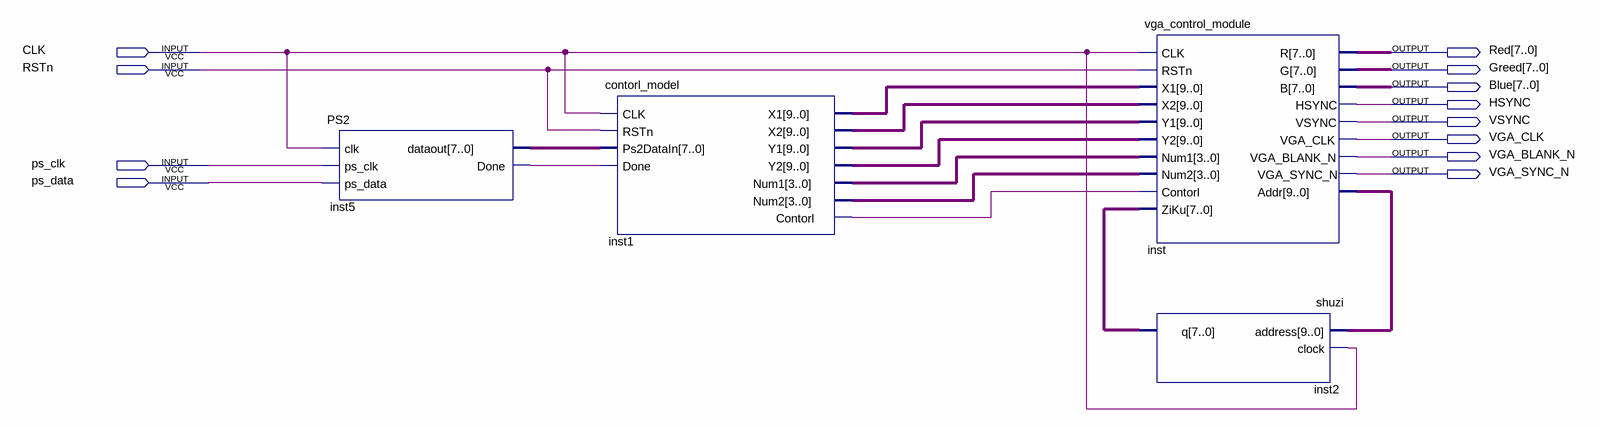
[diagram p0: schematic sheet]
// Quartus schematic top.bdf as structural Verilog: 4 symbols, 12 pins
module top (
  input  CLK,
  input  RSTn,
  input  ps_clk,
  input  ps_data,
  output [7:0] Red,
  output [7:0] Greed,
  output [7:0] Blue,
  output HSYNC,
  output VSYNC,
  output VGA_CLK,
  output VGA_BLANK_N,
  output VGA_SYNC_N
);

  wire inst1_contorl, inst5_done;
  wire [3:0] inst1_num1, inst1_num2;
  wire [7:0] inst2_q, inst5_dataout;
  wire [9:0] inst1_x1, inst1_x2, inst1_y1, inst1_y2, inst_addr;

  PS2 inst5 (.clk(CLK), .ps_clk(ps_clk), .ps_data(ps_data), .dataout(inst5_dataout), .Done(inst5_done));
  contorl_model inst1 (
    .CLK(CLK), .RSTn(RSTn), .Ps2DataIn(inst5_dataout), .Done(inst5_done), .X1(inst1_x1), .X2(inst1_x2),
    .Y1(inst1_y1), .Y2(inst1_y2), .Num1(inst1_num1), .Num2(inst1_num2), .Contorl(inst1_contorl));
  vga_control_module inst (
    .CLK(CLK), .RSTn(RSTn), .X1(inst1_x1), .X2(inst1_x2), .Y1(inst1_y1), .Y2(inst1_y2), .Num1(inst1_num1),
    .Num2(inst1_num2), .Contorl(inst1_contorl), .ZiKu(inst2_q), .R(Red), .G(Greed), .B(Blue), .HSYNC(HSYNC),
    .VSYNC(VSYNC), .VGA_CLK(VGA_CLK), .VGA_BLANK_N(VGA_BLANK_N), .VGA_SYNC_N(VGA_SYNC_N), .Addr(inst_addr));
  shuzi inst2 (.address(inst_addr), .clock(CLK), .q(inst2_q));
endmodule
